# EAGLE schematic Feuermelder (EAGLE 6.6.0)
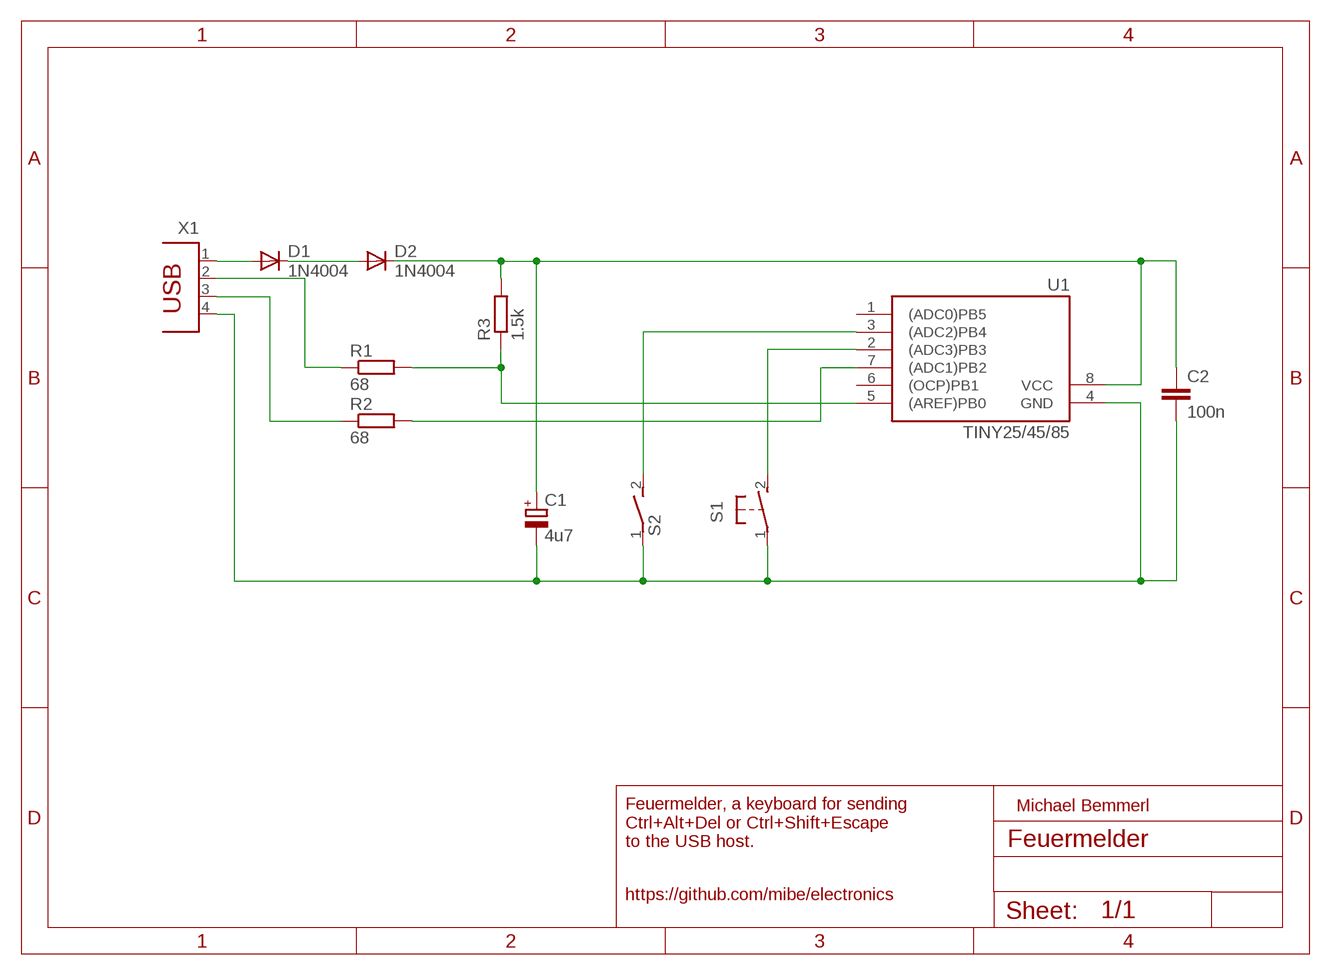
[diagram p0: schematic, sheet 1]

## Parts
C1  4u7  CPOL-EUE2.5-6  [E2,5-6]
C2  100n  C-EU050-025X075  [C050-025X075]
D1  1N4004  [DO41-10]
D2  1N4004  [DO41-10]
R1  68  R-EU_0207/10  [0207/10]
R2  68  R-EU_0207/10  [0207/10]
R3  1.5k  R-EU_0207/10  [0207/10]
S1  31-XX  [B3F-31XX]
S2  DS01E  [DS-01]
U1  TINY25/45/85  [DIL08]
X1  PN61729  [PN61729]

## Nets
3V6: C1.+ C2.1 D2.C R3.2 U1.8(VCC)
N$3: D1.C D2.A
N$5: R1.2 R3.1 U1.5((AREF)PB0)
N$7: R2.2 U1.7((ADC1)PB2)
N$8: S1.2(S) U1.2((ADC3)PB3)
N$10: S2.2 U1.3((ADC2)PB4)
USB_D+: R2.1 X1.3
USB_D-: R1.1 X1.2
USB_GND: C1.- C2.2 S1.1(P) S2.1 U1.4(GND) X1.4
USB_VCC: D1.A X1.1
Unconnected: U1.1((ADC0)PB5) U1.6((OCP)PB1)

## Notes on the sheet
- Michael Bemmerl
- Feuermelder, a keyboard for sending
  Ctrl+Alt+Del or Ctrl+Shift+Escape
  to the USB host.
- https://github.com/mibe/electronics

## Library data of the parts
C1 = resistor:CPOL-EU: POLARIZED CAPACITOR, European symbol
C2 = resistor:C-EU: CAPACITOR, European symbol
D1 D2 = diode:1N4004: DIODE general purpose rectifier, 1 A
R1-R3 = resistor:R-EU_: RESISTOR, European symbol
S1 = switch-omron:31-XX: OMRON SWITCH; MPN: B3F-3100; OC_FARNELL: 959704; OC_NEWARK: 36M3582
S2 = switch-dil:DS01E: DIL/CODE SWITCH; OC_FARNELL: unknown; OC_NEWARK: unknown
U1 = avr-7 ulli:TINY25/45/85
X1 = con-berg:PN61729: BERG USB connector; OC_FARNELL: unknown; OC_NEWARK: unknown